# EAGLE design schematic_fitband (EAGLE 9.6.2)
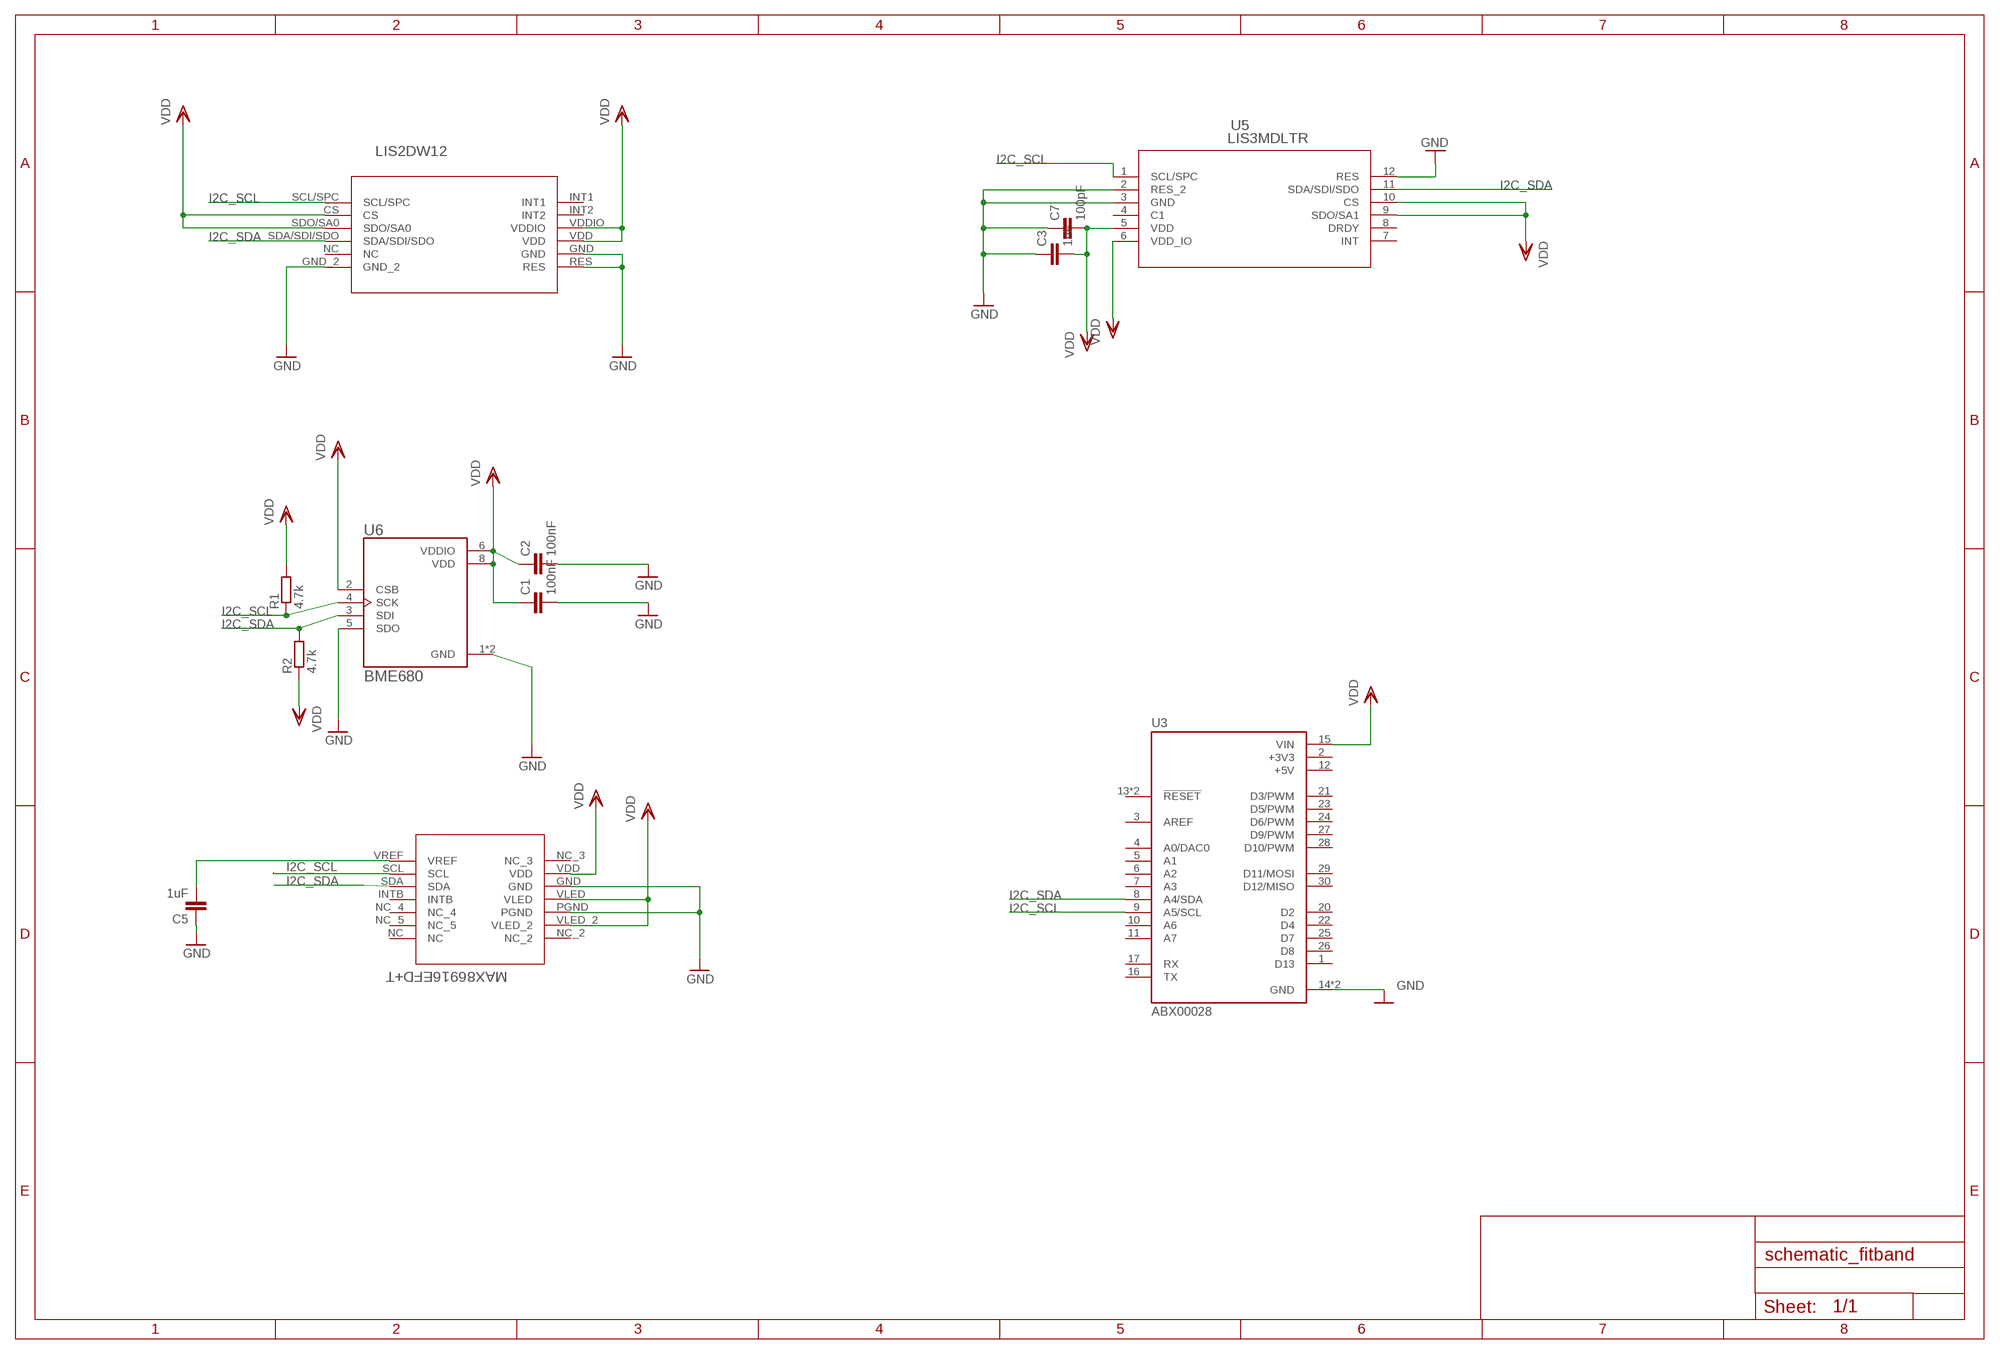
[diagram p0: schematic, sheet 1]

## Parts
C1  100nF  221E_PASSIVES_C0402  [221E_PASSIVES_C0402]
C2  100nF  221E_PASSIVES_C0402  [221E_PASSIVES_C0402]
C3  1uF  221E_PASSIVES_C0402  [221E_PASSIVES_C0402]
C5  1uF  221E_PASSIVES_C0402  [221E_PASSIVES_C0402]
C7  100pF  221E_PASSIVES_C0402  [221E_PASSIVES_C0402]
R1  4.7k  R-EU_MELF0204R  [MINI_MELF-0204R]
R2  4.7k  R-EU_MELF0204R  [MINI_MELF-0204R]
U1  MAX86916EFD+T  [21-100325_90-100122]
U2  LIS2DW12  [LIS2DW12_LGA-12_2X2X0P7_STM]
U3  ABX00028  [MODULE_ABX00028]
U5  LIS3MDLTR  [LGA-12_2X2X1_STM]
U6  BME680  [PSON80P300X300X100-8N]

## Nets
GND: C1.P$2 C2.P$2 C3.P$1 C5.P$1 C7.P$1 U1.GND U1.PGND U2.GND U2.GND_2 U2.RES U3.14(GND) U3.19(GND) U5.2(RES_2) U5.3(GND) U5.12(RES) U6.1(GND) U6.5(SDO) U6.7(GND)
I2C_SCL: R1.1 U1.SCL U2.SCL/SPC U3.9(A5/SCL) U5.1(SCL/SPC) U6.4(SCK)
I2C_SDA: R2.2 U1.SDA U2.SDA/SDI/SDO U3.8(A4/SDA) U5.11(SDA/SDI/SDO) U6.3(SDI)
N$1: C5.P$2 U1.VREF
N$5: R1.2 U6.2(CSB) ; supply symbol labelled VDD
VDD: C1.P$1 C2.P$1 C3.P$2 C7.P$2 R2.1 U1.VDD U1.VLED U1.VLED_2 U2.CS U2.SDO/SA0 U2.VDD U2.VDDIO U3.15(VIN) U5.5(VDD) U5.6(VDD_IO) U5.9(SDO/SA1) U5.10(CS) U6.6(VDDIO) U6.8(VDD)
Unconnected: U1.INTB U1.NC U1.NC_2 U1.NC_3 U1.NC_4 U1.NC_5 U2.INT1 U2.INT2 U2.NC U3.1(D13) U3.3(AREF) U3.4(A0/DAC0) U3.5(A1) U3.6(A2) U3.7(A3) U3.10(A6) U3.11(A7) U3.13(!RESET) U3.16(TX) U3.17(RX) U3.18(!RESET) U3.20(D2) U3.21(D3/PWM) U3.22(D4) U3.23(D5/PWM) U3.24(D6/PWM) U3.25(D7) U3.26(D8) U3.27(D9/PWM) U3.28(D10/PWM) U3.29(D11/MOSI) U3.30(D12/MISO) U5.4(C1) U5.7(INT) U5.8(DRDY)

## Power pins joined to a net without a drawn wire
+3V3: U3.2(+3V3)
+5V: U3.12(+5V)

## Library data of the parts
C1-C3 C5 C7 = PPG:221E_PASSIVES_C
R1 R2 = rcl:R-EU_: RESISTOR, European symbol; SPICEPREFIX: R
U1 = max86916:MAX86916EFD+T: Max86916 eagle component, it's a ppg sensor with 4 different leds; BUILT_BY: EMA_Rebekah; COPYRIGHT: Copyright (C) 2018 Accelerated Designs. All rights reserved; MANUFACTURER_PART_NUMBER: MAX86916EFD+T; SOURCELIBRARY: Maxim_2020-05-05; VENDOR: Maxim Integrated Products
U2 = LIS2DW12:LIS2DW12
U3 = ABX00028:ABX00028: ATmega4809 Arduino Nano Every AVR AVR MCU 8-Bit Embedded Evaluation Board Check availability <https://pricing.snapeda.com/parts/Arduino%20Nano%20Every/Arduino/view-part?ref=eda>; AVAILABILITY: Not in stock; DESCRIPTION: Arduino’s 5V compatible board in the smallest available form factor: 45x18mm!; MF: Arduino; MP: Arduino Nano Every; PACKAGE: None; PRICE: None
U5 = LIS3MDLTR:LIS3MDLTR; COPYRIGHT: Copyright (C) 2023 Ultra Librarian. All rights reserved.; MANUFACTURER_PART_NUMBER: LIS3MDLTR; MFR_NAME: STMicroelectronics
U6 = BME680:BME680: Integrated Environmental Unit Check availability <https://pricing.snapeda.com/parts/BME680/Bosch%20Sensortec/view-part?ref=eda>; AVAILABILITY: In Stock; DESCRIPTION: Gas, Humidity, Pressure, Temperature Sensor I²C, SPI Output; MF: Bosch Sensortec; MP: BME680; PACKAGE: LGA-8 Bosch Tools; PRICE: None; PURCHASE-URL: https://pricing.snapeda.com/search/part/BME680/?ref=eda

## Board
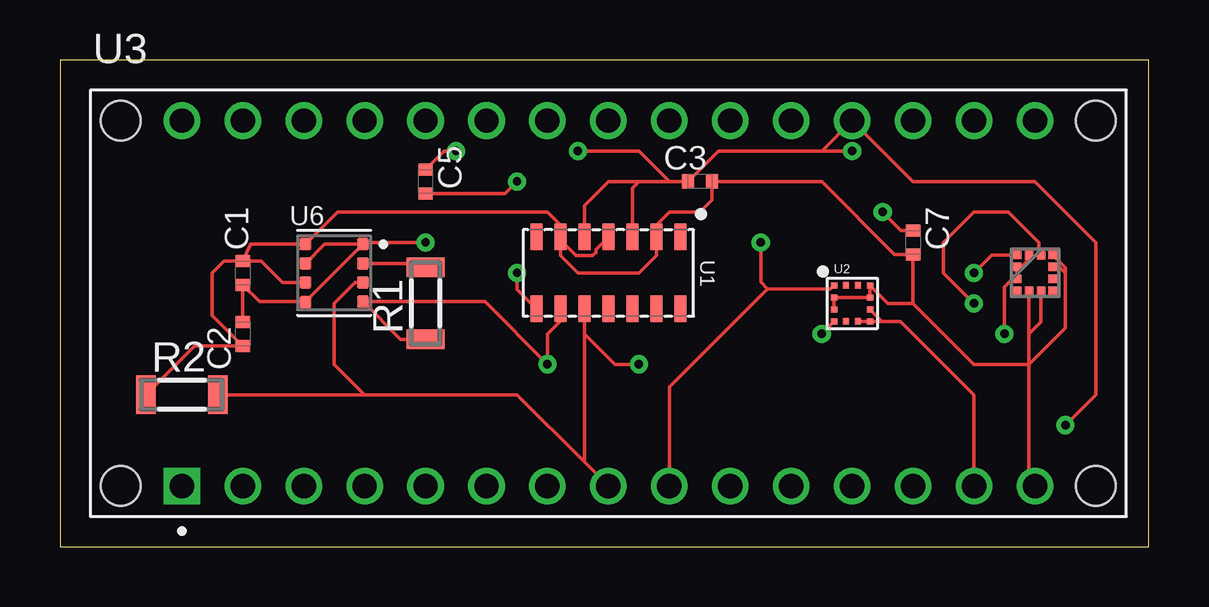
[diagram p1: board, top side]
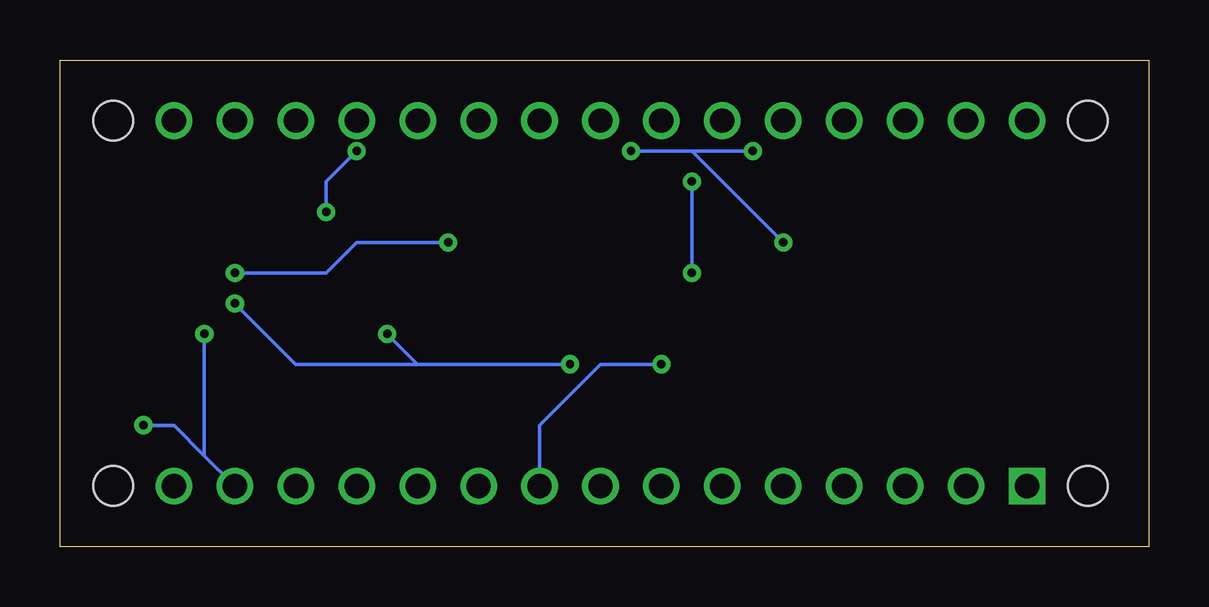
[diagram p2: board, bottom side, seen from below]

Size 45.39 x 20.31 mm. Coordinates in mm from the lower left corner, seen from the top.
Outline: 0,0 45.39,0 45.39,20.31 0,20.31 0,0
Copper layers (1*16): Top 0.035mm / dielectric 1.5mm / Bottom 0.035mm
Design rules "default": minimum track width 6mil, minimum drill 0.35mm, track to track 6mil, track to pad 6mil, pad to pad 6mil, via to via 6mil, smd to smd 6mil, copper to edge 40mil, drill to drill 6mil, minimum pad ring 10mil, minimum via ring 8mil, stop-mask expansion 4mil, vias tented up to drill 0mil, thermal gap 10mil

### Footprints (pad centres in the part's own frame; a part is rotated, then mirrored left to right if it is on the bottom)
221E_PASSIVES_C0402 = smd 0.5 x 0.6: P$1 -0.5,0; P$2 0.5,0
MINI_MELF-0204R = smd 0.8 x 1.6: 1 -1.5,0; 2 1.5,0
21-100325_90-100122 = smd 1.1 x 0.5: GND -1.5,-1; INTB 1.5,0; NC 1.5,3; NC_2 -1.5,3; NC_3 -1.5,-3; NC_4 1.5,1; NC_5 1.5,2; PGND -1.5,1; SCL 1.5,-2; SDA 1.5,-1; VDD -1.5,-2; VLED -1.5,0; VLED_2 -1.5,2; VREF 1.5,-3
LIS2DW12_LGA-12_2X2X0P7_STM = smd 0.275 x 0.25: CS -0.75,0.25; GND 0.75,-0.25; RES 0.75,-0.75; SCL/SPC -0.75,0.75; SDA/SDI/SDO -0.75,-0.75; SDO/SA0 -0.75,-0.25; VDD 0.75,0.25; VDDIO 0.75,0.75 | smd 0.25 x 0.275: GND_2 0.25,-0.75; INT1 -0.25,0.75; INT2 0.25,0.75; NC -0.25,-0.75
MODULE_ABX00028 = drill 1.016 square: 1 -17.78,-7.62 | drill 1.016: 2 -15.24,-7.62; 3 -12.7,-7.62; 4 -10.16,-7.62; 5 -7.62,-7.62; 6 -5.08,-7.62; 7 -2.54,-7.62; 8 0,-7.62; 9 2.54,-7.62; 10 5.08,-7.62; 11 7.62,-7.62; 12 10.16,-7.62; 13 12.7,-7.62; 14 15.24,-7.62; 15 17.78,-7.62; 16 17.78,7.62; 17 15.24,7.62; 18 12.7,7.62; 19 10.16,7.62; 20 7.62,7.62; 21 5.08,7.62; 22 2.54,7.62; 23 0,7.62; 24 -2.54,7.62; 25 -5.08,7.62; 26 -7.62,7.62; 27 -10.16,7.62; 28 -12.7,7.62; 29 -15.24,7.62; 30 -17.78,7.62 | hole 1.651: -20.32,-7.62; -20.32,7.62; 20.32,7.62; 20.32,-7.62
LGA-12_2X2X1_STM = smd 0.377 x 0.352: 1 -0.75,0.75; 2 -0.75,0.25; 3 -0.75,-0.25; 4 -0.75,-0.75; 7 0.75,-0.75; 8 0.75,-0.25; 9 0.75,0.25; 10 0.75,0.75 | smd 0.352 x 0.377: 5 -0.25,-0.75; 6 0.25,-0.75; 11 0.25,0.75; 12 -0.25,0.75
PSON80P300X300X100-8N = smd 0.5 x 0.5: 1 1.2,1.2; 2 1.2,0.4; 3 1.2,-0.4; 4 1.2,-1.2; 5 -1.2,-1.22; 6 -1.2,-0.4; 7 -1.2,0.4; 8 -1.2,1.2

### Placement (x,y rotation side)
C1  7.62,11.43 270 top
C2  7.62,8.89 90 top
C3  26.67,15.24 0 top
C5  15.24,15.24 270 top
C7  35.56,12.7 270 top
R1  15.24,10.16 90 top
R2  5.08,6.35 0 top
U1  22.86,11.43 270 top
U2  33.02,10.16 0 top
U3  22.86,10.16 0 top
U5  40.64,11.43 0 top
U6  11.43,11.43 0 top

### Tracks (layer width: path | path; a pad name or v marks a point on that pad's centre or on a via)
GND  (via drill 0.35)
  Top 0.152: 34.27,9.41 U2.RES U2.GND_2 | 34.27,9.41 35.04,9.41 38.1,6.35 U3.14 | U2.GND 34.27,9.41 | 10.23,10.23 U6.5 | U6.1 10.23,10.23 | U6.7 11.03,12.63 U6.1 | C2.P$2 C1.P$2 8.32,10.23 10.23,10.23 | U1.PGND 23.86,14.97 24.13,15.24 | 24.13,15.24 25.4,15.24 | 25.4,15.24 C3.P$1 27.44,16.51 31.75,16.51 | 31.75,16.51 U3.19 35.56,15.24 40.64,15.24 43.18,12.7 43.18,6.35 v41.91,5.08 | U1.GND 21.86,14.24 22.86,15.24 24.13,15.24 | U5.12 40.31,12.1 40.31,11.91 40.08,11.68 U5.2 U5.3 39.79,11.08 39.61,11.08 39.37,10.85 v39.37,8.89 | 31.75,16.51 v33.02,16.51 | C7.P$1 35.06,13.2 v34.29,13.97 | U6.1 12.7,12.7 v15.24,12.7 | v21.59,16.51 24.13,16.51 25.4,15.24 | C5.P$1 16.01,16.51 v16.51,16.51
  Bottom 0.152: v39.37,8.89 39.37,3.81 | U3.14 39.37,3.81 | v33.02,16.51 34.29,15.24 v34.29,13.97 | 39.37,3.81 40.64,5.08 v41.91,5.08 | v15.24,12.7 19.05,16.51 | 19.05,16.51 v21.59,16.51 | v16.51,16.51 19.05,16.51
I2C_SCL  (via drill 0.35)
  Top 0.152: U1.SCL 20.86,9.43 20.32,8.89 v20.32,7.62 17.71,10.23 U6.4 14.2,8.66 R1.1 | U2.SCL/SPC 32.12,10.76 29.5,10.76 | U3.9 25.4,6.67 29.5,10.76 | U5.1 38.85,12.18 v38.1,11.43 | v29.21,12.7 29.21,11.05 29.5,10.76
  Bottom 0.152: v20.32,7.62 22.86,7.62 25.4,5.08 U3.9 | v38.1,11.43 34.29,11.43 33.02,12.7 v29.21,12.7
I2C_SDA  (via drill 0.35)
  Top 0.152: U1.SDA 21.86,8.89 | 21.86,8.89 21.86,3.54 | 21.86,3.54 U3.8 | 21.86,3.54 19.05,6.35 12.7,6.35 | U6.3 12.3,11.03 11.43,10.16 11.43,7.62 12.7,6.35 | U2.SDA/SDI/SDO v31.75,8.89 | v24.13,7.62 23.13,7.62 21.86,8.89 | R2.2 12.7,6.35 | U5.11 40.79,12.28 40.79,12.7 39.52,13.97 38.1,13.97 36.83,12.7 36.83,11.43 v38.1,10.16
  Bottom 0.152: v31.75,8.89 30.48,7.62 | 30.48,7.62 v24.13,7.62 | v38.1,10.16 35.56,7.62 30.48,7.62
N$1  (via drill 0.35)
  Top 0.152: C5.P$2 18.55,14.74 v19.05,15.24 | U1.VREF 19.05,10.74 v19.05,11.43
  Bottom 0.152: v19.05,15.24 v19.05,11.43
N$5
  Top 0.152: U6.2 15.07,11.83 R1.2
VDD
  Top 0.152: U6.6 9.29,11.03 8.39,11.93 C1.P$1 | C1.P$1 7.94,12.63 U6.8 11.57,13.97 20.32,13.97 20.86,13.43 U1.VDD 20.86,12.7 | C1.P$1 6.85,11.93 6.35,11.43 6.35,9.66 C2.P$1 5.62,8.39 R2.1 | U2.SDO/SA0 U2.CS U2.VDD U2.VDDIO 34.52,10.16 35.56,10.16 | U3.15 40.39,2.79 40.39,7.62 | 40.39,8.89 40.39,7.62 | 40.39,8.89 U5.5 | U5.6 40.89,9.39 40.39,8.89 | 40.39,7.62 41.91,9.14 41.91,11.43 | 41.91,11.43 41.66,11.68 U5.9 | 41.91,11.43 41.91,11.66 U5.10 | 40.39,7.62 38.1,7.62 35.56,10.16 | 35.56,10.16 C7.P$2 34.79,12.2 31.75,15.24 C3.P$2 27.17,14.47 26.67,13.97 25.4,13.97 24.86,13.43 U1.VLED_2 24.86,12.16 24.13,11.43 21.59,11.43 20.86,12.16 20.86,12.7 | U1.VLED 22.34,12.41 22.34,12.29 22.2,12.15 21.52,12.15 20.97,12.7 20.86,12.7